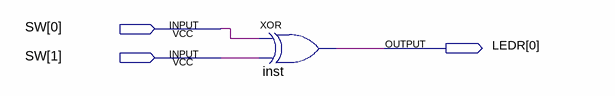
[diagram p0: schematic sheet]
// Quartus schematic Simon1.bdf as structural Verilog: 1 symbols, 3 pins
module Simon1 (
  input  [1:0] SW,
  output [0:0] LEDR
);

  xor inst (LEDR[0], SW[0], SW[1]);
endmodule
